# Altium schematic sheet Relay.SchDoc
size A
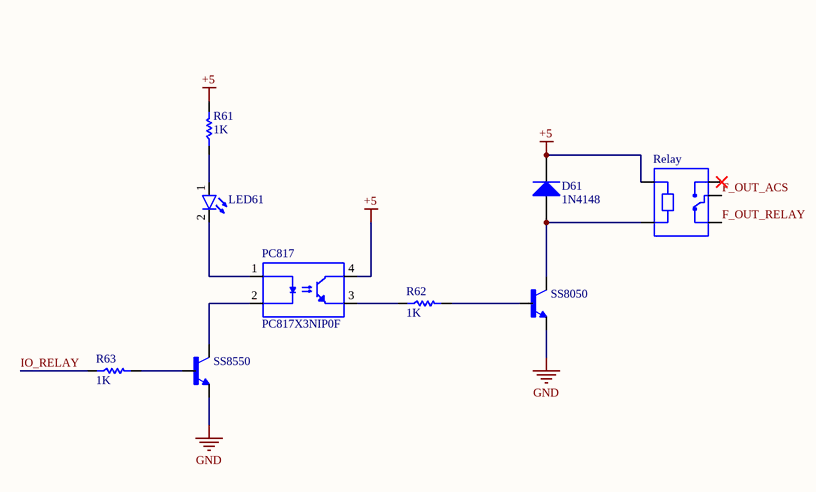
[diagram p0: Relay.SchDoc]

## Parts
D61  1N4148  [LL4148]
LED61  Red  [LED_SMD_0805]  (value not drawn)
PC817  PC817X3NIP0F  [SOIC254P1000X400-4N]
R61  1K  [SMD_RES_0805]
R62  1K  [RES 0805 (2012X06L)]
R63  1K  [RES 0805 (2012X06L)]
Relay  SRD-05VDC-SL-C  [RELAY_SRD-05VDC-SL-C]  (value not drawn)
SS8050  BCW31*  [SOT23-BEC]  (value not drawn)
SS8550  BCW31*  [SOT23-BEC]  (value not drawn)

## Nets
+5: D61.2(K) PC817.4(COLLECTOR) R61.2 Relay.A1
GND: SS8050.E SS8550.E
F_OUT_ACS: Relay.COM
F_OUT_RELAY: Relay.NC
IO_RELAY: R63.1
NetD61_1: D61.1(A) Relay.A2 SS8050.C
NetLED61_1: LED61.1(A) R61.1
NetLED61_2: LED61.2(K) PC817.1(ANODE)
NetPC817_2: PC817.2(CATHODE) SS8550.C
NetPC817_3: PC817.3(EMITTER) R62.1
NetR62_2: R62.2 SS8050.B
NetR63_2: R63.2 SS8550.B

Not connected (* = marked no-connect by the designer): Relay NO*

## Library data of the parts
D61 = Diode 1N4148: High Conductance Fast Diode; Published: 8-Jun-2000; LatestRevisionDate: 17-Jul-2002; LatestRevisionNote: Re-released for DXP Platform.; DatasheetVersion: 1997; PackageReference: DO-35; Publisher: Altium Limited; PackageDescription: Diode, Axial; Body 3.8 x 1.9 mm (LxDia. max), Lead Dia. 0.53 mm (max); Code_JEDEC: DO-204-AH; ComponentLink1Description: Manufacturer Link; ComponentLink1URL: http://www.fairchildsemi.com/; ComponentLink2Description: Datasheet; ComponentLink2URL: http://www.fairchildsemi.com/ds/1N%2F1N4148.pdf
LED61 = LED: Designer: Saeid Jorablo; Organazation: ControTec; Adding Date: 1387/12/22; Color: Red; Size: SMD 1206
PC817 = PC817X3NIP0F: Optoisolator Transistor Output 5000Vrms 1 Channel 4-SMD; MF: SHARP/Socle Technology; Price: None; Availability: Unavailable; Package: SMD-4 SOCLE Technology; SnapEDA_Link: https://www.snapeda.com/parts/PC817X3NIP0F/SHARP/Socle%20Technology/view-part/2774503/?ref=snap; MP: PC817X3NIP0F; Value: *
R61-R63 = Resistor: Tolerance: 5%; Power: 1/8 W; Value: 1K
Relay = SRD-05VDC-SL-C: 5V Trigger Relay Module For Arduino And Raspberry Pi 5V Trigger Relay Module For Arduino And Raspberry Pi; MF: Songle Relay; Package: None; Availability: Unavailable; Value: *; MP: SRD-05VDC-SL-C; SnapEDA_Link: https://www.snapeda.com/parts/SRD-05VDC-SL-C/Songle%20Relay/view-part/1029484/?ref=snap; Price: None
SS8050 SS8550 = BCW31*: Bipolar _BJT_ Transistor NPN General Purpose Amplifier Surface Mount; MF: ON Semiconductor; MP: BCW31; Package: SOT-23 ON Semiconductor; Value: *; Availability: Unavailable; SnapEDA_Link: https://www.snapeda.com/parts/BCW31/ON%20Semiconductor/view-part/573820/?ref=snap; Price: None